# Altium schematic sheet TopLevel.SchDoc: =project_title
size Tabloid; PageSetup: Record=PageOptions|CenterHorizontal=True|CenterVertical=True|PrintScale=0.73|XCorrection=1.00|YCorrection=1.00|PrintKind=0|BorderSize=5000000|LeftOffset=0|BottomOffset=0|Orientation=2|PaperLength=1000|PaperWidth=1000|Scale=100|PaperSource=7|PrintQuality=-4|MediaType=1|DitherType=10|PaperKind=A4|PrintScaleMode=1; CompanyName: Luxonis Holding; Organization: Luxonis Holding; Address1: 1925 Harmony Park Drive; Address2: Westminster, CO; Address3: 80234; Address4: United States; SheetNumber: 2; SheetTotal: 9
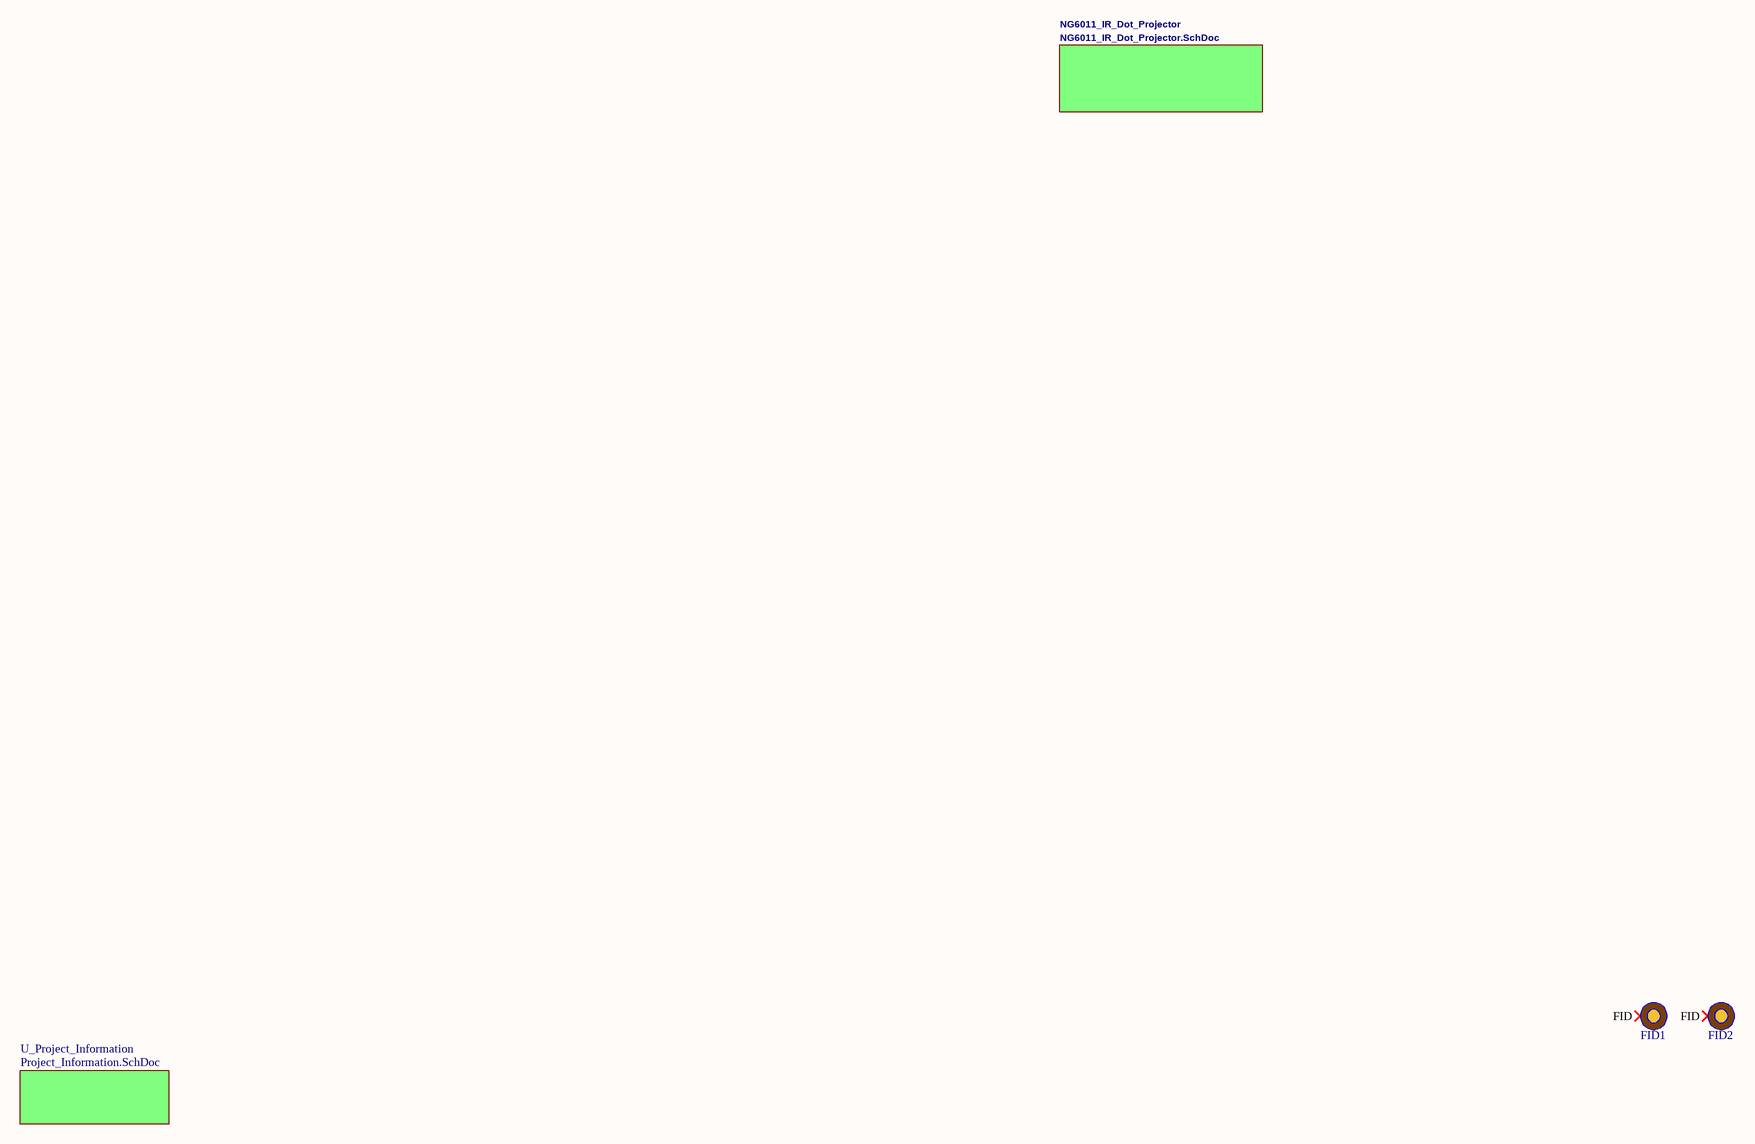
[diagram p0: TopLevel.SchDoc]

## Parts
FID1  FIDUCIAL_ROUND_1MM  [FIDUCIAL_ROUND_1MM]  (value not drawn)  (no BOM)
FID2  FIDUCIAL_ROUND_1MM  [FIDUCIAL_ROUND_1MM]  (value not drawn)  (no BOM)

## Sub-sheets
NG6011_IR_Dot_Projector = NG6011_IR_Dot_Projector.SchDoc: no entries
U_Project_Information = Project_Information.SchDoc: no entries

## Nets

Not connected (* = marked no-connect by the designer): FID1 FID*; FID2 FID*

## Notes on the sheet
- Title
- Size:
- Date:
- Tabloid
- Number:
- Time:
- Revision:
- Sheet
- of
- Drawn by:

## Library data of the parts
FID1 FID2 = FIDUCIAL: Fiducial with various available footprints